# Altium project LedRing.PrjPCB
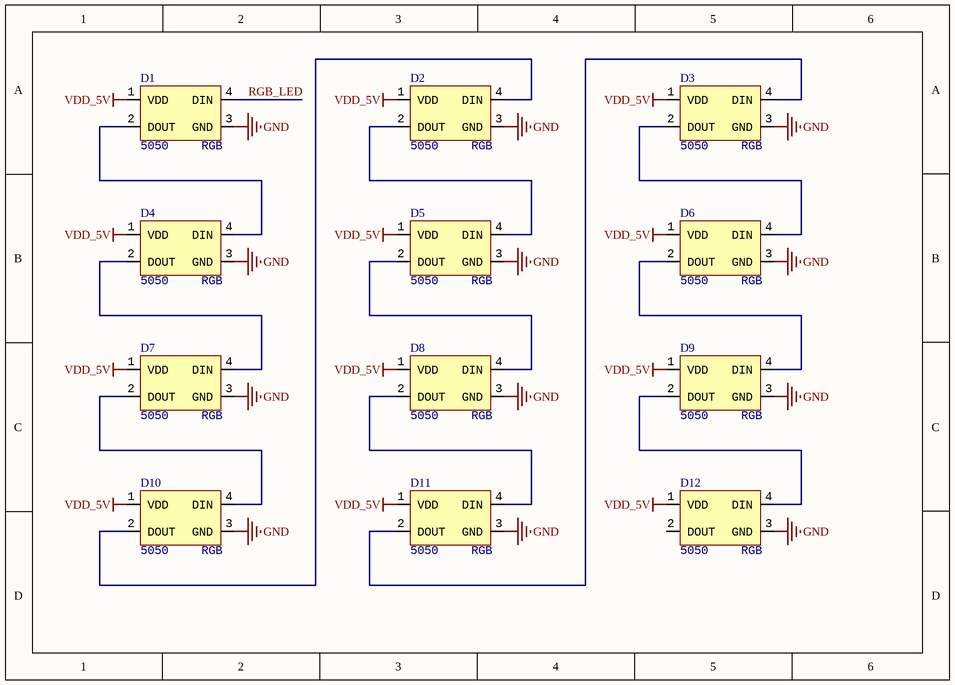
[diagram p0: Main.SchDoc]
1 sheet, 12 parts. Net scope: global (net labels, ports and power ports of the same name join across sheets).
Board file: LedRing.PcbDoc

## Sheet Main.SchDoc
size 177 x 127 mm

### Parts
D1  Type: 5050  [LED_5050_WS2812B]  (hidden comment: RGB)
D2  Type: 5050  [LED_5050_WS2812B]  (hidden comment: RGB)
D3  Type: 5050  [LED_5050_WS2812B]  (hidden comment: RGB)
D4  Type: 5050  [LED_5050_WS2812B]  (hidden comment: RGB)
D5  Type: 5050  [LED_5050_WS2812B]  (hidden comment: RGB)
D6  Type: 5050  [LED_5050_WS2812B]  (hidden comment: RGB)
D7  Type: 5050  [LED_5050_WS2812B]  (hidden comment: RGB)
D8  Type: 5050  [LED_5050_WS2812B]  (hidden comment: RGB)
D9  Type: 5050  [LED_5050_WS2812B]  (hidden comment: RGB)
D10  Type: 5050  [LED_5050_WS2812B]  (hidden comment: RGB)
D11  Type: 5050  [LED_5050_WS2812B]  (hidden comment: RGB)
D12  Type: 5050  [LED_5050_WS2812B]  (hidden comment: RGB)

### Nets
GND: D1.3(GND) D2.3(GND) D3.3(GND) D4.3(GND) D5.3(GND) D6.3(GND) D7.3(GND) D8.3(GND) D9.3(GND) D10.3(GND) D11.3(GND) D12.3(GND)
VDD_5V: D1.1(VDD) D2.1(VDD) D3.1(VDD) D4.1(VDD) D5.1(VDD) D6.1(VDD) D7.1(VDD) D8.1(VDD) D9.1(VDD) D10.1(VDD) D11.1(VDD) D12.1(VDD)
RGB_LED: D1.4(DIN)
NetD1_2: D1.2(DOUT) D4.4(DIN)
NetD2_2: D2.2(DOUT) D5.4(DIN)
NetD2_4: D2.4(DIN) D10.2(DOUT)
NetD3_2: D3.2(DOUT) D6.4(DIN)
NetD3_4: D3.4(DIN) D11.2(DOUT)
NetD4_2: D4.2(DOUT) D7.4(DIN)
NetD5_2: D5.2(DOUT) D8.4(DIN)
NetD6_2: D6.2(DOUT) D9.4(DIN)
NetD7_2: D7.2(DOUT) D10.4(DIN)
NetD8_2: D8.2(DOUT) D11.4(DIN)
NetD9_2: D9.2(DOUT) D12.4(DIN)

Not connected (* = marked no-connect by the designer): D12 2(DOUT)

### Library data of the parts
D1-D12 = LED_5050_WS2812B: LED; Value: RGB